# Altium schematic sheet DSP_Supply.SchDoc
size A4
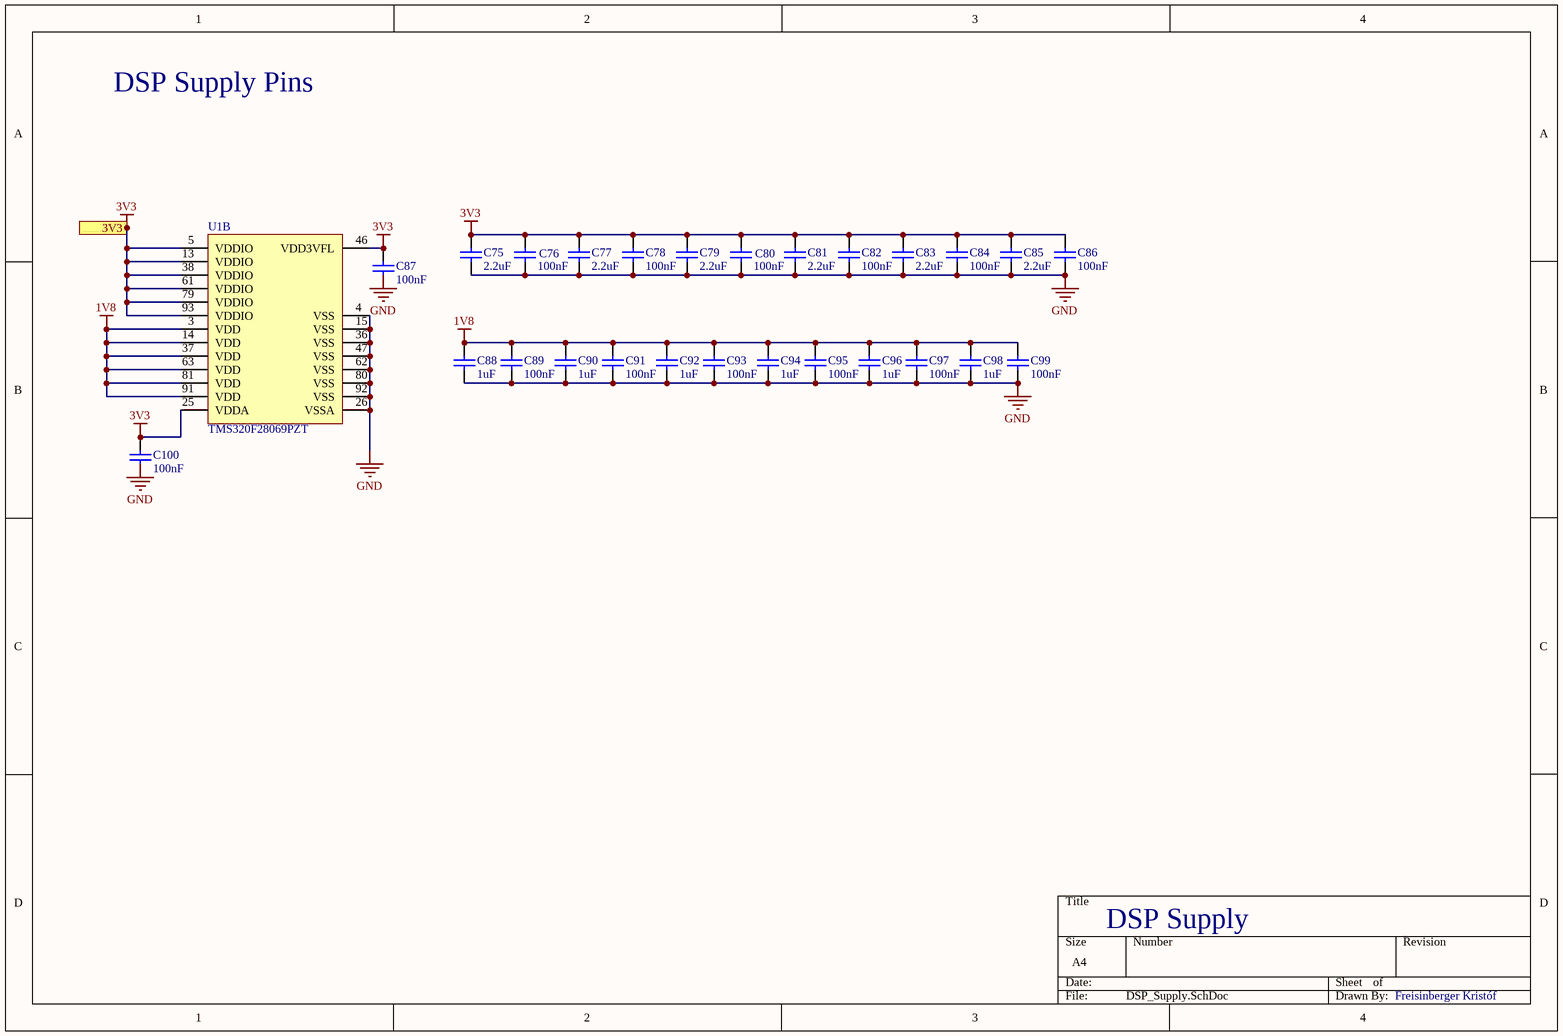
[diagram p0: DSP_Supply.SchDoc]

## Parts
C75  2.2uF  [FP_0805_CAP_085]
C76  100nF  [FP_0805_CAP_085]
C77  2.2uF  [FP_0805_CAP_085]
C78  100nF  [FP_0805_CAP_085]
C79  2.2uF  [FP_0805_CAP_085]
C80  100nF  [FP_0805_CAP_085]
C81  2.2uF  [FP_0805_CAP_085]
C82  100nF  [FP_0805_CAP_085]
C83  2.2uF  [FP_0805_CAP_085]
C84  100nF  [FP_0805_CAP_085]
C85  2.2uF  [FP_0805_CAP_085]
C86  100nF  [FP_0805_CAP_085]
C87  100nF  [FP_0805_CAP_085]
C88  1uF  [FP_0805_CAP_085]
C89  100nF  [FP_0805_CAP_085]
C90  1uF  [FP_0805_CAP_085]
C91  100nF  [FP_0805_CAP_085]
C92  1uF  [FP_0805_CAP_085]
C93  100nF  [FP_0805_CAP_085]
C94  1uF  [FP_0805_CAP_085]
C95  100nF  [FP_0805_CAP_085]
C96  1uF  [FP_0805_CAP_085]
C97  100nF  [FP_0805_CAP_085]
C98  1uF  [FP_0805_CAP_085]
C99  100nF  [FP_0805_CAP_085]
C100  100nF  [FP_0805_CAP_085]
U1  TMS320F28069PZT  [PZ0100A_N]  (part B of 2)

## Ports
3V3

## Nets
1V8: C88.2 C89.2 C90.2 C91.2 C92.2 C93.2 C94.2 C95.2 C96.2 C97.2 C98.2 C99.2 U1.3(VDD) U1.14(VDD) U1.37(VDD) U1.63(VDD) U1.81(VDD) U1.91(VDD)
3V3: C75.2 C76.2 C77.2 C78.2 C79.2 C80.2 C81.2 C82.2 C83.2 C84.2 C85.2 C86.2 C87.2 C100.2 U1.5(VDDIO) U1.13(VDDIO) U1.25(VDDA) U1.38(VDDIO) U1.46(VDD3VFL) U1.61(VDDIO) U1.79(VDDIO) U1.93(VDDIO) ; port 3V3
GND: C75.1 C76.1 C77.1 C78.1 C79.1 C80.1 C81.1 C82.1 C83.1 C84.1 C85.1 C86.1 C88.1 C89.1 C90.1 C91.1 C92.1 C93.1 C94.1 C95.1 C96.1 C97.1 C98.1 C99.1 U1.4(VSS) U1.15(VSS) U1.26(VSSA) U1.36(VSS) U1.47(VSS) U1.62(VSS) U1.80(VSS) U1.92(VSS)

Not connected (* = marked no-connect by the designer): C87 1; C100 1

## Notes on the sheet
- DSP Supply Pins
- DSP Supply
- Freisinberger Kristóf
- Labels drawn without touching a wire or pin: GND

## Library data of the parts
C75-C100 = CAP: Capacitor
  C75 C77 C79 C81 C83 C85: Value: 2.2uF
  C76 C78 C80 C82 C84 C86 C87 C89 C91 C93 C95 C97 C99 C100: Value: 100nF
  C88 C90 C92 C94 C96 C98: Value: 1uF
U1 = DSP_100_CMP-0546-00052-3: Piccolo Microcontroller, High-Efficiency 32-Bit CPU, 100 KB, 90 MHz, FPU, VCU, 19 Ch PWM, 54 GPIO, 3.3 V, -40 to 105 degC, 100-Pin LQFP (PZ), Green (RoHS & no Sb/Br); Manufacturer: Texas Instruments; CAP/QEP: 7/2; Peak MMACS: 90; IO Supply (V): 3.3; 12-bit A/D (#Channels): 16; PWM (Ch): 19; CLA: 1; Timers: 3 32-Bit GP 1 WD; VCU: Yes; RAM (KB): 100; CPU: C28x; GPIO: 54; USB: 0; PackageVersion: 4040149/B; Operating Temperature Range (degC): -40 to 105; Mounting Technology: Surface Mount; ComponentLink2URL: http://www.ti.com/lit/ds/symlink/tms320f28069.pdf; DatasheetVersion: SPRS698D; PartNumber: TMS320F28069PZT; FPU: Yes; Frequency (MHz): 90; ComponentLink3Description: Package Specification; ComponentLink3URL: http://www.ti.com/lit/ds/symlink/tms320f28066.pdf; PackageDescription: 100-Pin Plastic Quad Flat Package, Body 14 x 14 mm, Pitch 0.5 mm; PackageReference: PZ0100A; ComponentLink1URL: http://www.ti.com/; ComponentLink2Description: Datasheet; ComponentLink1Description: Manufacturer URL; Eco Plan: Green (RoHS & no Sb/Br)